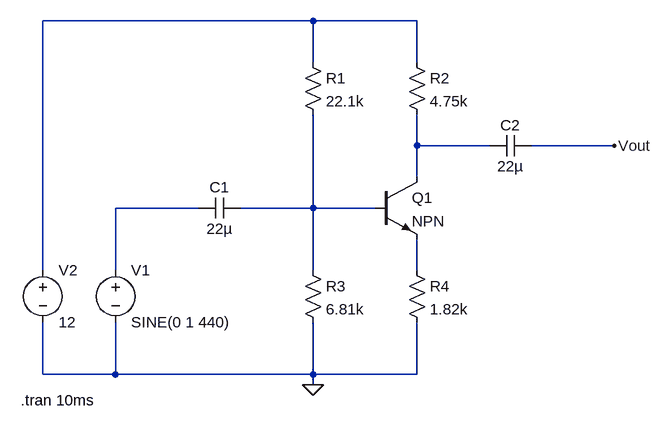
[diagram p0: schematic common_emitter.asc]
common_emitter.asc, the LTspice schematic file:
Version 4
SHEET 1 880 680
WIRE 48 -128 -368 -128
WIRE 208 -128 48 -128
WIRE 48 -64 48 -128
WIRE 208 -64 208 -128
WIRE 208 64 208 16
WIRE 320 64 208 64
WIRE 512 64 384 64
WIRE 208 112 208 64
WIRE -128 160 -256 160
WIRE 48 160 48 16
WIRE 48 160 -64 160
WIRE 144 160 48 160
WIRE -368 256 -368 -128
WIRE -256 256 -256 160
WIRE 48 256 48 160
WIRE 208 256 208 208
WIRE -368 416 -368 336
WIRE -256 416 -256 336
WIRE -256 416 -368 416
WIRE 48 416 48 336
WIRE 48 416 -256 416
WIRE 208 416 208 336
WIRE 208 416 48 416
WIRE 48 432 48 416
FLAG 48 432 0
FLAG 512 64 Vout
SYMBOL npn 144 112 R0
SYMATTR InstName Q1
SYMBOL res 192 240 R0
SYMATTR InstName R4
SYMATTR Value 1.82k
SYMBOL res 32 240 R0
SYMATTR InstName R3
SYMATTR Value 6.81k
SYMBOL cap -64 144 R90
WINDOW 0 0 32 VBottom 2
WINDOW 3 32 32 VTop 2
SYMATTR InstName C1
SYMATTR Value 22µ
SYMBOL voltage -256 240 R0
WINDOW 123 0 0 Left 0
WINDOW 39 0 0 Left 0
SYMATTR InstName V1
SYMATTR Value SINE(0 1 440)
SYMBOL voltage -368 240 R0
WINDOW 123 0 0 Left 0
WINDOW 39 0 0 Left 0
SYMATTR InstName V2
SYMATTR Value 12
SYMBOL res 32 -80 R0
SYMATTR InstName R1
SYMATTR Value 22.1k
SYMBOL res 192 -80 R0
SYMATTR InstName R2
SYMATTR Value 4.75k
SYMBOL cap 384 48 R90
WINDOW 0 0 32 VBottom 2
WINDOW 3 32 32 VTop 2
SYMATTR InstName C2
SYMATTR Value 22µ
TEXT -402 456 Left 2 !.tran 10ms

The netlist it stands for:
* common_emitter.asc
Q1 N002 N004 N005 0 NPN
R4 N005 0 1.82k
R3 N004 0 6.81k
C1 N004 N003 22µ
V1 N003 0 SINE(0 1 440)
V2 N001 0 12
R1 N001 N004 22.1k
R2 N001 N002 4.75k
C2 Vout N002 22µ
.model NPN NPN
.model PNP PNP
.lib standard.bjt
.tran 10ms
.backanno
.end